# EAGLE design DRV8825_SHIELD_V3 (EAGLE 9.6.2)
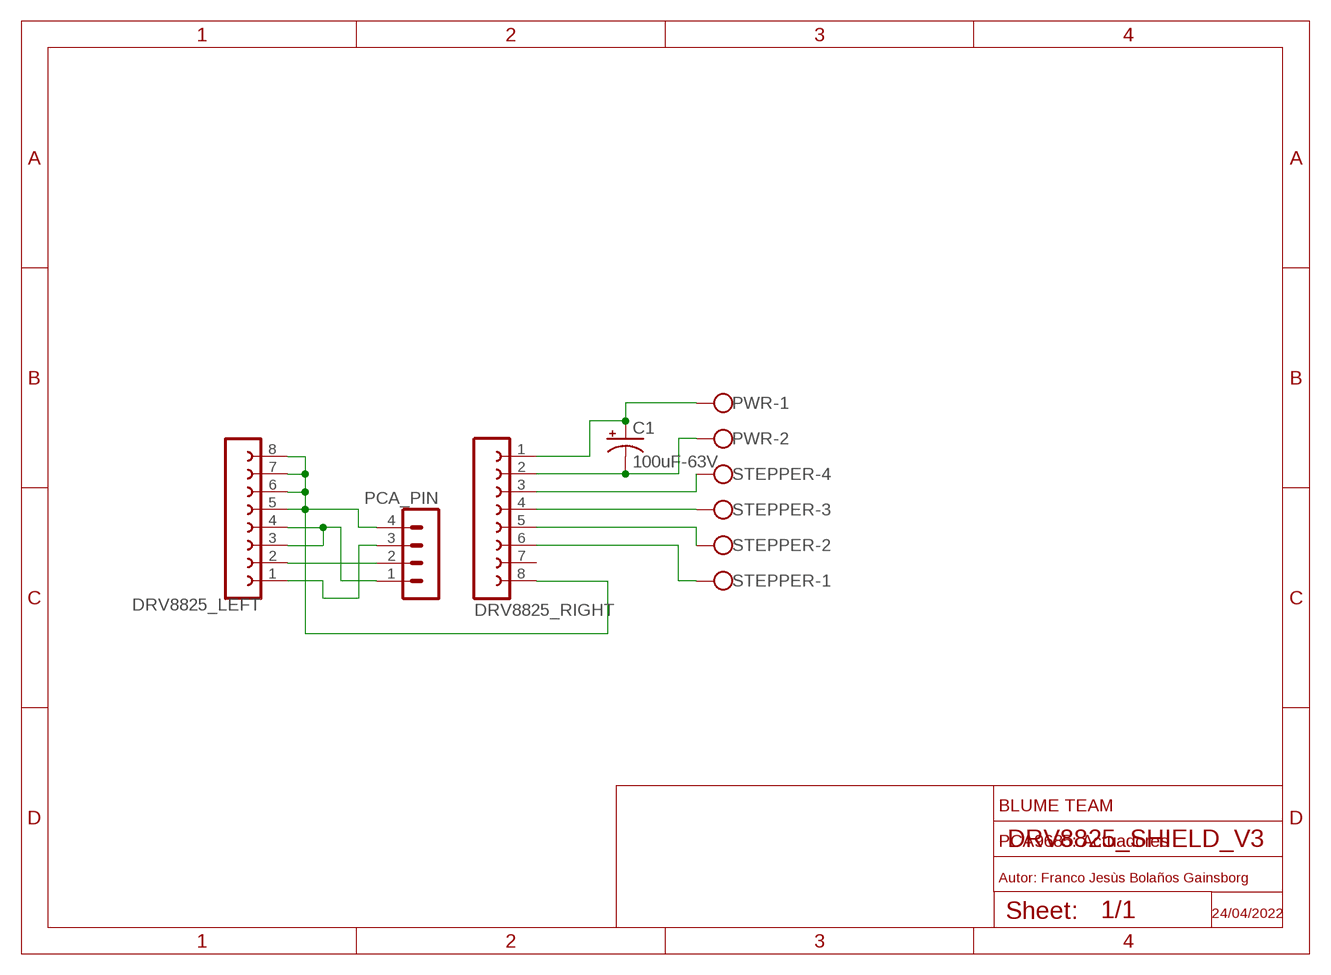
[diagram p0: schematic, sheet 1]

## Parts
C1  100uF-63V  CPOL-USE5-10.5  [E5-10,5]
DRV8825_LEFT  FE08-1  [FE08]
DRV8825_RIGHT  FE08-1  [FE08]
PCA_PIN  MA04-1  [MA04-1]
PWR  W237-102  [W237-102]
STEPPER  W237-4  [W237-4]

## Nets
N$1: DRV8825_RIGHT.3 STEPPER.4
N$2: DRV8825_RIGHT.4 STEPPER.3
N$3: DRV8825_LEFT.2 PCA_PIN.2
N$4: DRV8825_LEFT.1 PCA_PIN.3
N$5: C1.+ DRV8825_RIGHT.1 PWR.1
N$6: C1.- DRV8825_RIGHT.2 PWR.2
N$8: DRV8825_LEFT.3 DRV8825_LEFT.4 PCA_PIN.1
N$9: DRV8825_RIGHT.5 STEPPER.2
N$10: DRV8825_RIGHT.6 STEPPER.1
N$11: DRV8825_LEFT.5 DRV8825_LEFT.6 DRV8825_LEFT.7 DRV8825_LEFT.8 DRV8825_RIGHT.8 PCA_PIN.4
Unconnected: DRV8825_RIGHT.7

## Notes on the sheet
- BLUME TEAM
- PCA9685: Actuadores
- Autor: Franco Jesùs Bolaños Gainsborg
- 24/04/2022

## Library data of the parts
C1 = rcl:CPOL-US: POLARIZED CAPACITOR, American symbol; SPICEPREFIX: C
DRV8825_LEFT DRV8825_RIGHT = con-lsta:FE08-1: FEMALE HEADER; OC_FARNELL: unknown; OC_NEWARK: unknown
PCA_PIN = con-lstb:MA04-1: PIN HEADER; OC_FARNELL: unknown; OC_NEWARK: unknown
PWR = con-wago-500:W237-102: WAGO SCREW CLAMP; MPN: 237-102; OC_FARNELL: unknown; OC_NEWARK: 70K9898
STEPPER = con-wago-500:W237-4: WAGO SCREW CLAMP; OC_FARNELL: unknown; OC_NEWARK: unknown

## Board
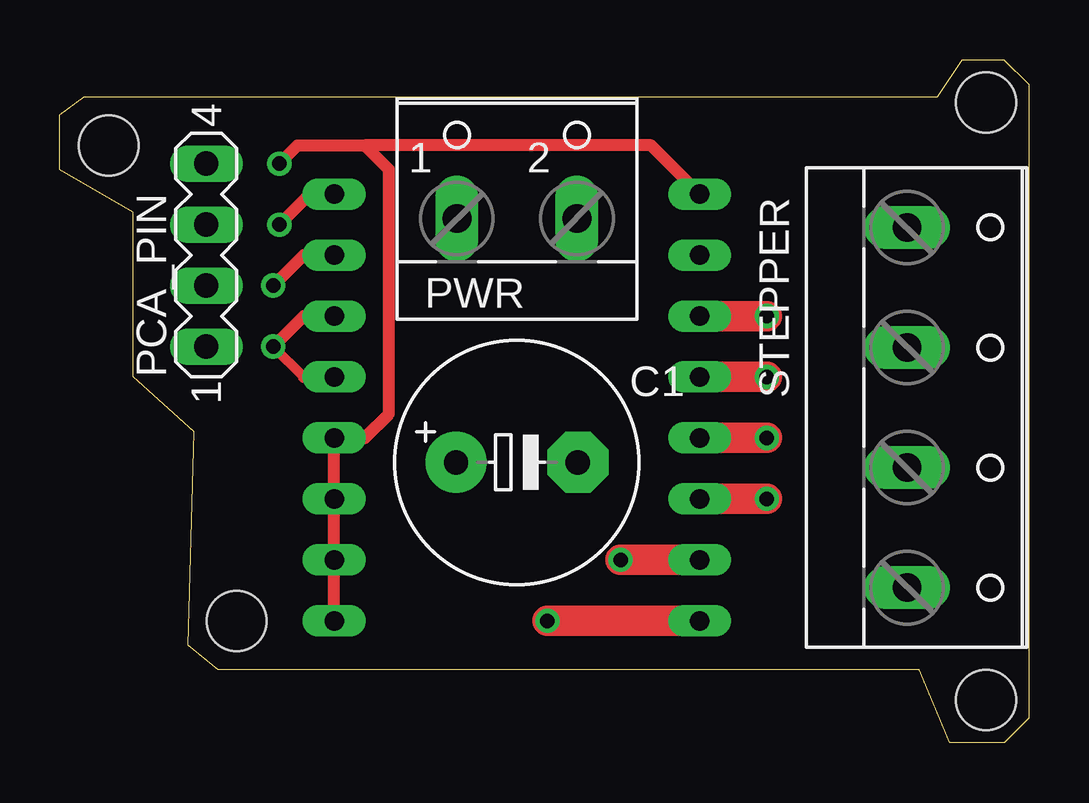
[diagram p1: board, top side]
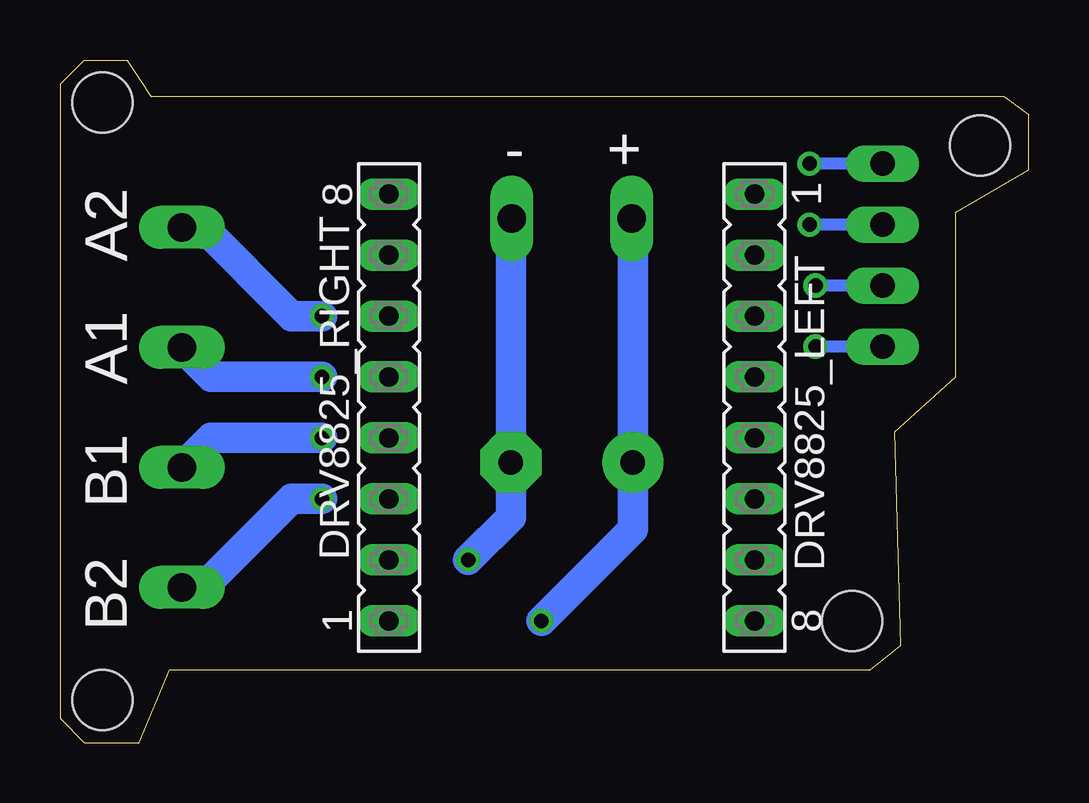
[diagram p2: board, bottom side, seen from below]

Size 40.39 x 28.45 mm. Coordinates in mm from the lower left corner, seen from the top.
Outline: 37.59,28.45 36.58,26.92 1.02,26.92 0,26.16 0,23.88 3.05,22.1 3.05,15.24 5.59,12.95 5.33,4.06 6.6,3.05 35.81,3.05 37.08,0 39.37,0 40.39,1.02 40.39,27.43 39.37,28.45 37.59,28.45
Copper layers (1*16): Top 0.035mm / dielectric 1.5mm / Bottom 0.035mm
Design rules "default": minimum track width 6mil, minimum drill 0.35mm, track to track 6mil, track to pad 6mil, pad to pad 6mil, via to via 6mil, smd to smd 6mil, copper to edge 40mil, drill to drill 6mil, minimum pad ring 10mil, minimum via ring 8mil, stop-mask expansion 4mil, vias tented up to drill 0mil, thermal gap 10mil
Holes 2.5 mm at 38.61,26.67 2.03,24.89 7.37,5.08 38.61,1.78

### Footprints (pad centres in the part's own frame; a part is rotated, then mirrored left to right if it is on the bottom)
E5-10,5 = drill 1.016 pad 2.54: + -2.54,0 | drill 1.016 pad 2.54 octagon: - 2.54,0
FE08 = drill 0.813 long: 1 -8.89,0; 2 -6.35,0; 3 -3.81,0; 4 -1.27,0; 5 1.27,0; 6 3.81,0; 7 6.35,0; 8 8.89,0
MA04-1 = drill 1.016 long: 1 -3.81,0; 2 -1.27,0; 3 1.27,0; 4 3.81,0
W237-102 = drill 1.194 long: 1 -2.5,-1.27; 2 2.5,-1.27
W237-4 = drill 1.194 long: 1 -7.5,-1.27; 2 -2.5,-1.27; 3 2.5,-1.27; 4 7.5,-1.27

### Placement (x,y rotation side)
C1  19.05,11.68 0 top
DRV8825_LEFT  11.43,13.97 270 bottom
DRV8825_RIGHT  26.67,13.97 90 bottom
PCA_PIN  6.1,20.32 90 top
PWR  19.05,23.11 0 top
STEPPER  36.58,13.97 270 top

### Tracks (layer width: path | path; a pad name or v marks a point on that pad's centre or on a via)
N$1  (via drill 0.6)
  Top 1.27: DRV8825_RIGHT.3 v29.46,10.16
  Bottom 1.27: STEPPER.4 34.42,6.47 30.73,10.16 v29.46,10.16
N$2  (via drill 0.6)
  Top 1.27: DRV8825_RIGHT.4 v29.46,12.7
  Bottom 1.27: STEPPER.3 34.08,12.7 v29.46,12.7
N$3  (via drill 0.6)
  Top 0.406: 10.16,20.32 DRV8825_LEFT.2
  Top 0.508: v8.89,19.05 10.16,20.32
  Bottom 0.508: PCA_PIN.2 v8.89,19.05
N$4  (via drill 0.6)
  Top 0.508: DRV8825_LEFT.1 10.41,22.86 v9.14,21.59
  Bottom 0.508: PCA_PIN.3 v9.14,21.59
N$5  (via drill 0.6)
  Top 1.27: v20.32,5.08 DRV8825_RIGHT.1
  Bottom 1.27: PWR.1 16.51,21.8 C1.+ 16.51,8.89 v20.32,5.08
N$6  (via drill 0.6)
  Top 0.152: PWR.2 21.59,21.8
  Top 1.27: DRV8825_RIGHT.2 v23.37,7.62
  Bottom 1.27: PWR.2 21.59,21.8 C1.- 21.59,9.4 v23.37,7.62
N$8  (via drill 0.6)
  Top 0.406: 10.16,15.24 v8.89,16.51
  Top 0.508: v8.89,16.51 10.16,17.78 DRV8825_LEFT.3 | DRV8825_LEFT.4 10.16,15.24
  Bottom 0.508: PCA_PIN.1 v8.89,16.51
N$9  (via drill 0.6)
  Top 1.27: DRV8825_RIGHT.5 v29.46,15.24
  Bottom 1.27: STEPPER.2 34.08,15.24 v29.46,15.24
N$10  (via drill 0.6)
  Top 1.27: DRV8825_RIGHT.6 v29.46,17.78
  Bottom 1.27: STEPPER.1 34.42,21.47 30.73,17.78 v29.46,17.78
N$11  (via drill 0.6)
  Top 0.508: DRV8825_RIGHT.8 24.64,24.89 12.7,24.89 | 12.7,24.89 13.72,23.88 13.72,13.72 12.7,12.7 DRV8825_LEFT.5 DRV8825_LEFT.6 DRV8825_LEFT.7 DRV8825_LEFT.8 | v9.14,24.13 9.91,24.89 12.7,24.89
  Bottom 0.508: PCA_PIN.4 v9.14,24.13

### Text on the board
bPlace: - + | B2 B1 A1 A2
Measures: VCC STEP DIR GND